# EasyEDA Pro project Schematic.epro

# Schematic Schematic1
Board Name: Board1; Create Date: 2026-02-08; Page Name: P1; Project Name: Hexapod; Schematic Name: Schematic1; Update Date: 2026-02-10; Company: EasyEDA.com; Page Size: A4; Version: V1.0
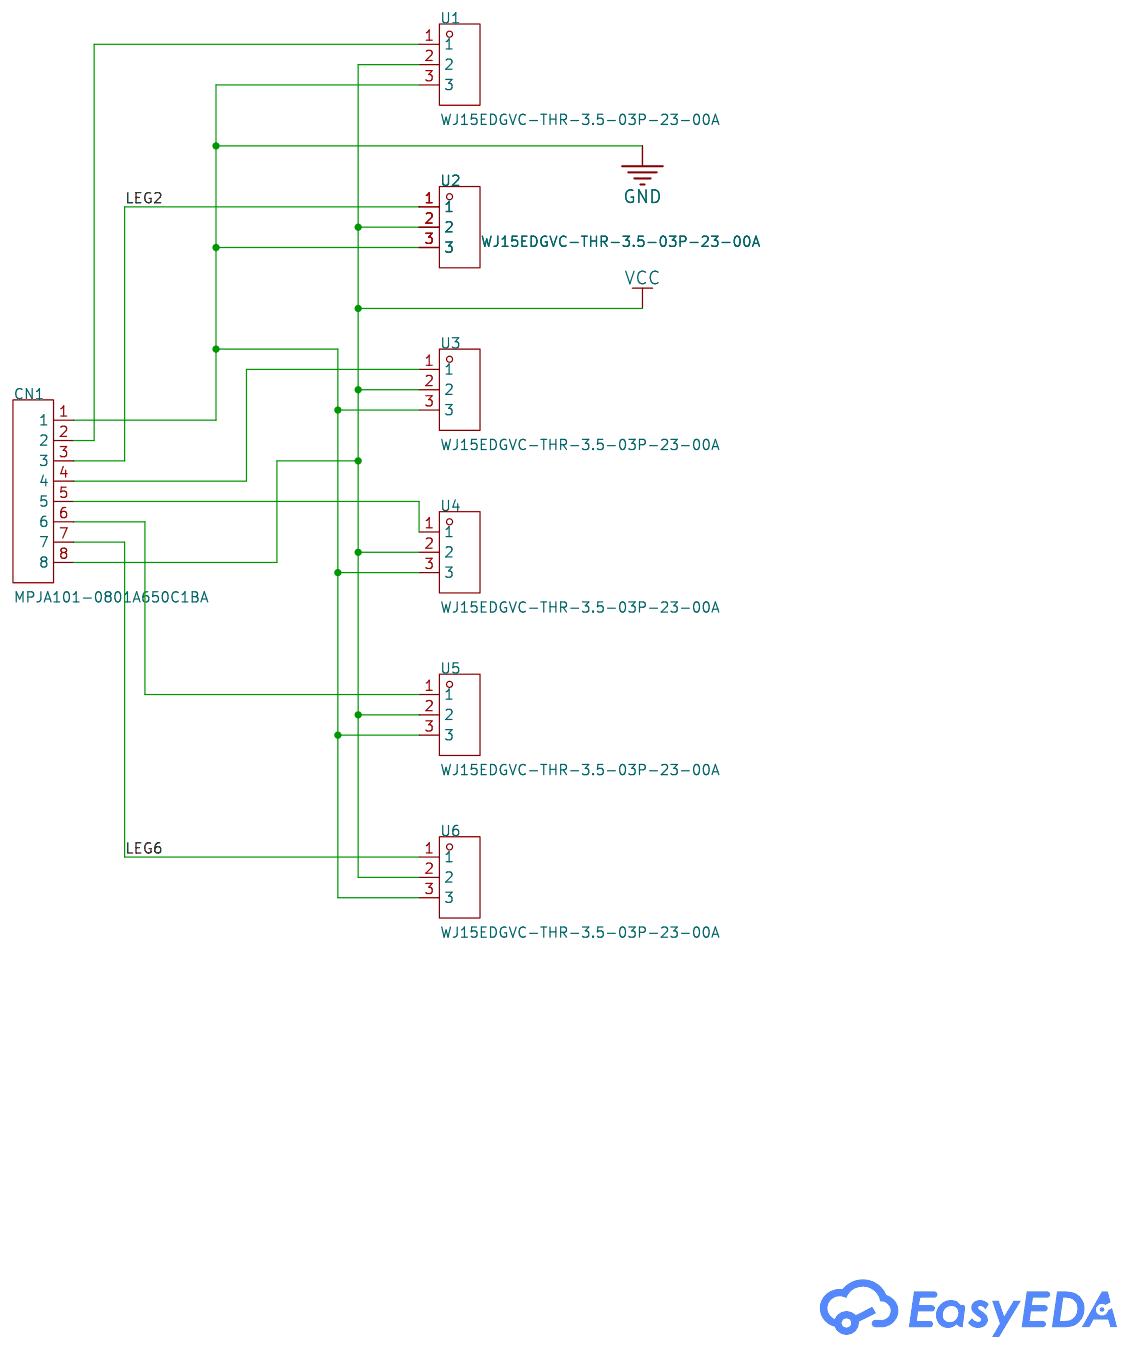
[diagram p0: schematic sheet]

## Parts
CN1  MPJA101-0801A650C1BA  [HDR-TH_8P-P3.96-V-M_C9900009548]
U1  WJ15EDGVC-THR-3.5-03P-23-00A  [CONN-TH_3P-P3.50_WJ15EDGVC-THR-3.5-03P-23-00A]
U2  WJ15EDGVC-THR-3.5-03P-23-00A  [CONN-TH_3P-P3.50_WJ15EDGVC-THR-3.5-03P-23-00A]
U3  WJ15EDGVC-THR-3.5-03P-23-00A  [CONN-TH_3P-P3.50_WJ15EDGVC-THR-3.5-03P-23-00A]
U4  WJ15EDGVC-THR-3.5-03P-23-00A  [CONN-TH_3P-P3.50_WJ15EDGVC-THR-3.5-03P-23-00A]
U5  WJ15EDGVC-THR-3.5-03P-23-00A  [CONN-TH_3P-P3.50_WJ15EDGVC-THR-3.5-03P-23-00A]
U6  WJ15EDGVC-THR-3.5-03P-23-00A  [CONN-TH_3P-P3.50_WJ15EDGVC-THR-3.5-03P-23-00A]

## Library data of the parts
CN1 = MPJA101-0801A650C1BA: Supplier Part: C9900009548; Supplier Footprint: 3.96间距公座8PIN空偶数PIN; JLCPCB Part Class: Extended Part; Supplier: LCSC
U1-U6 = WJ15EDGVC-THR-3.5-03P-23-00A: Supplier Part: C9900098328; Supplier Footprint: connector; JLCPCB Part Class: Extended Part; Supplier: LCSC

## Nets
GND: CN1.1 U1.3 U2.3 U3.3 U4.3 U5.3 U6.3
VCC: CN1.8 U1.2 U2.2 U3.2 U4.2 U5.2 U6.2
LEG2: CN1.3 U2.1
LEG6: CN1.7 U6.1
Net-(CN1-2): CN1.2 U1.1
Net-(CN1-4): CN1.4 U3.1
Net-(CN1-5): CN1.5 U4.1
Net-(CN1-6): CN1.6 U5.1
